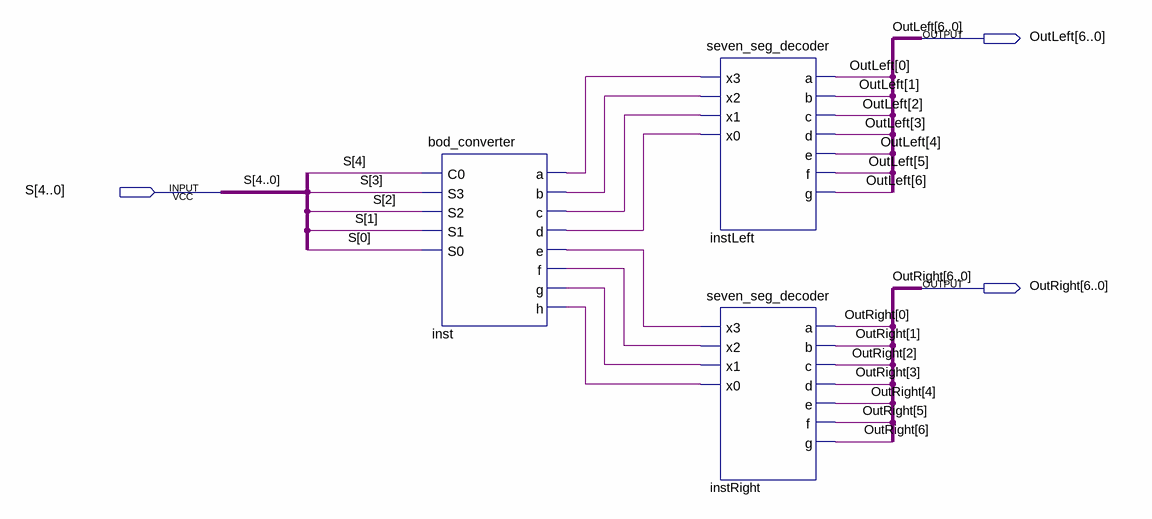
[diagram p0: schematic sheet]
// Quartus schematic HexOutput.bdf as structural Verilog: 3 symbols, 3 pins
module HexOutput (
  input  [4:0] S,
  output [6:0] OutLeft,
  output [6:0] OutRight
);

  wire inst_a, inst_b, inst_c, inst_d, inst_e, inst_f, inst_g, inst_h;

  bod_converter inst (
    .C0(S[4]), .S3(S[3]), .S2(S[2]), .S1(S[1]), .S0(S[0]), .a(inst_a), .b(inst_b), .c(inst_c), .d(inst_d),
    .e(inst_e), .f(inst_f), .g(inst_g), .h(inst_h));
  seven_seg_decoder instLeft (
    .x3(inst_a), .x2(inst_b), .x1(inst_c), .x0(inst_d), .a(OutLeft[0]), .b(OutLeft[1]), .c(OutLeft[2]),
    .d(OutLeft[3]), .e(OutLeft[4]), .f(OutLeft[5]), .g(OutLeft[6]));
  seven_seg_decoder instRight (
    .x3(inst_e), .x2(inst_f), .x1(inst_g), .x0(inst_h), .a(OutRight[0]), .b(OutRight[1]), .c(OutRight[2]),
    .d(OutRight[3]), .e(OutRight[4]), .f(OutRight[5]), .g(OutRight[6]));
endmodule
